# Altium schematic sheet jtag.SchDoc
size A4; SheetNumber: 4; SheetTotal: 7
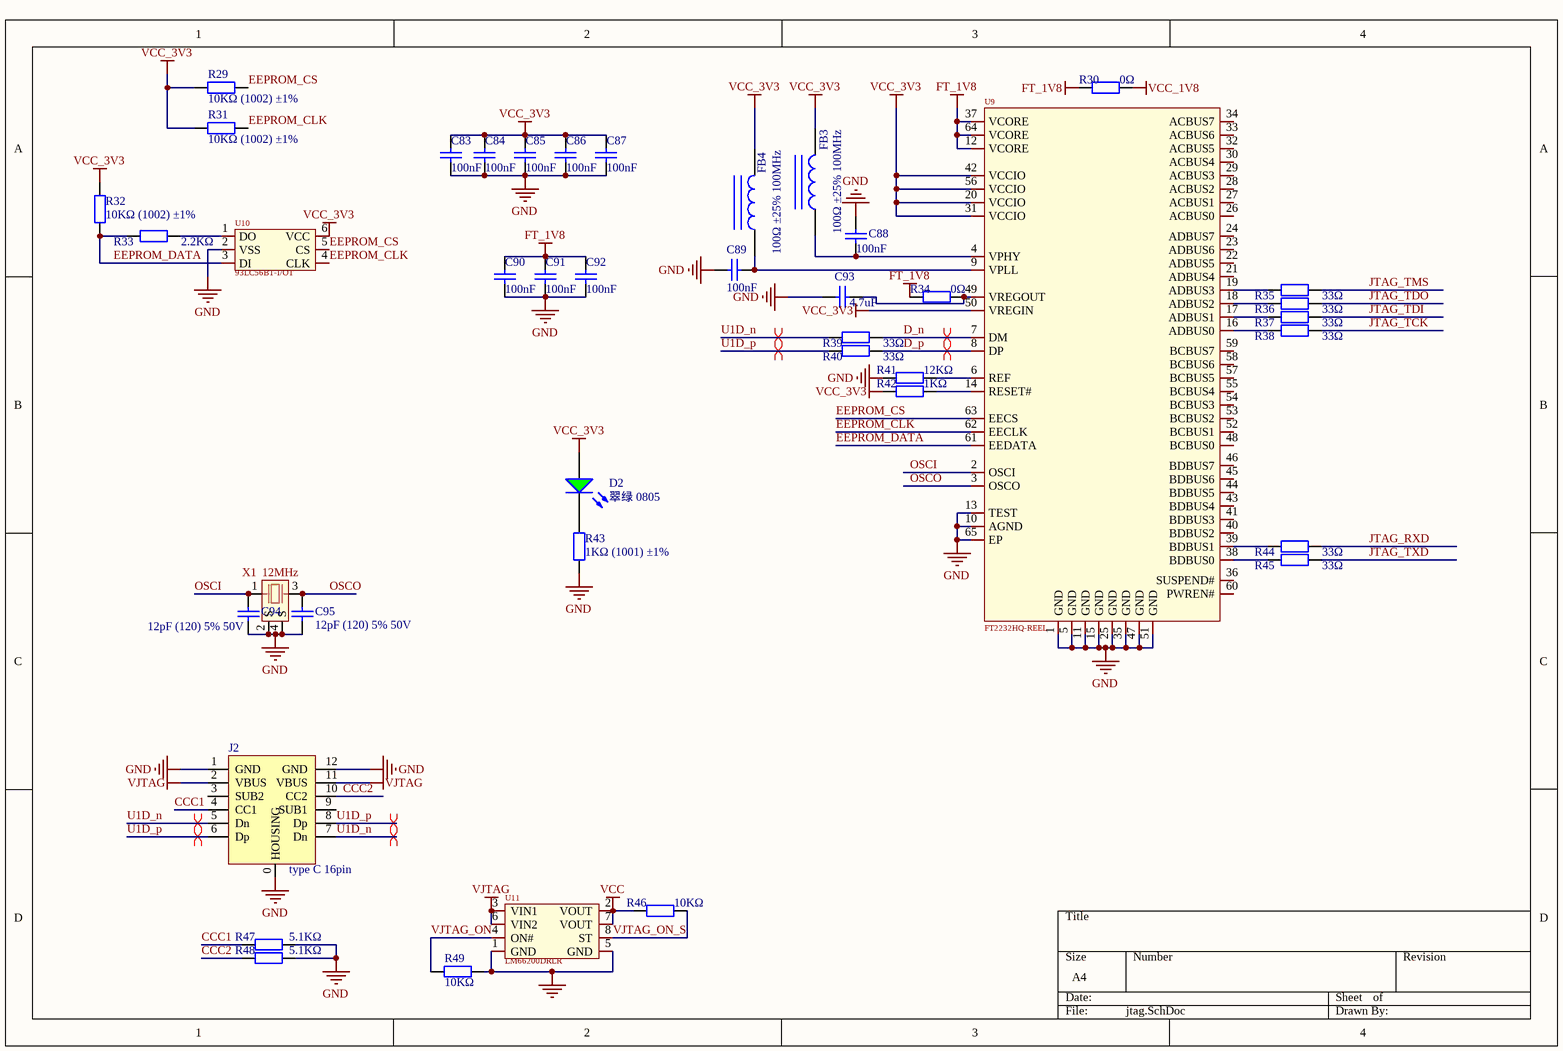
[diagram p0: jtag.SchDoc]

## Parts
C83  100nF  [0805_C]
C84  100nF  [0805_C]
C85  100nF  [0805_C]
C86  100nF  [0805_C]
C87  100nF  [0805_C]
C88  100nF  [0805_C]
C89  100nF  [0805_C]
C90  100nF  [0805_C]
C91  100nF  [0805_C]
C92  100nF  [0805_C]
C93  4.7uF  [0805_C]
C94  12pF (120) 5% 50V  [0805_C]
C95  12pF (120) 5% 50V  [0805_C]
D2  翠绿 0805  [0805_LED_S1]
FB3  100Ω ±25% 100MHz  [0805_L]
FB4  100Ω ±25% 100MHz  [0805_L]
J2  type C 16pin  [USB type C  16pin]
R29  10KΩ (1002) ±1%  [0805_R]
R30  0Ω  [0402_R]
R31  10KΩ (1002) ±1%  [0805_R]
R32  10KΩ (1002) ±1%  [0805_R]
R33  2.2KΩ  [0805_R]
R34  0Ω  [0402_R]
R35  33Ω  [0402_R]
R36  33Ω  [0402_R]
R37  33Ω  [0402_R]
R38  33Ω  [0402_R]
R39  33Ω  [0402_R]
R40  33Ω  [0402_R]
R41  12KΩ  [0805_R]
R42  1KΩ  [0805_R]
R43  1KΩ (1001) ±1%  [0805_R]
R44  33Ω  [0402_R]
R45  33Ω  [0402_R]
R46  10KΩ  [0805_R]
R47  5.1KΩ  [0805_R]
R48  5.1KΩ  [0805_R]
R49  10KΩ  [0805_R]
U9  FT2232HQ-REEL  [QFN-64_L9.0-W9.0-P0.50-TL-EP4.3]
U10  93LC56BT-I/OT  [SOT-23-6_L2.9-W1.6-P0.95-LS2.8-BR]
U11  LM66200DRLR  [SOT-583-8_L2.1-W1.2-P0.50-LS1.6-BL]
X1  12MHz  [3225]

## Nets
FT_1V8: C90.2 C91.2 C92.2 R30.1 R34.1 U9.12(VCORE) U9.37(VCORE) U9.64(VCORE)
GND: C83.1 C84.1 C85.1 C86.1 C87.1 C88.2 C89.2 C90.1 C91.1 C92.1 C93.1 C94.1 C95.1 J2.0(HOUSING) J2.1(GND) J2.12(GND) R41.1 R43.1 R47.2 R48.2 R49.1 U9.1(GND) U9.5(GND) U9.10(AGND) U9.11(GND) U9.13(TEST) U9.15(GND) U9.25(GND) U9.35(GND) U9.47(GND) U9.51(GND) U9.65(EP) U10.2(VSS) U11.1(GND) U11.5(GND) X1.2(S) X1.4(S)
VCC: R46.1 U11.2(VOUT) U11.7(VOUT)
VCC_1V8: R30.2
VCC_3V3: C83.2 C84.2 C85.2 C86.2 C87.2 D2.A FB3.2 FB4.2 R29.2 R31.2 R32.2 R42.1 U9.20(VCCIO) U9.31(VCCIO) U9.42(VCCIO) U9.50(VREGIN) U9.56(VCCIO) U10.6(VCC)
VJTAG: J2.2(VBUS) J2.11(VBUS) U11.3(VIN1) U11.6(VIN2)
CCC1: J2.4(CC1) R47.1
CCC2: J2.10(CC2) R48.1
D_n: R39.2 U9.7(DM)
D_p: R40.2 U9.8(DP)
EEPROM_CLK: R31.1 U9.62(EECLK) U10.4(CLK)
EEPROM_CS: R29.1 U9.63(EECS) U10.5(CS)
EEPROM_DATA: R32.1 R33.1 U9.61(EEDATA) U10.3(DI)
JTAG_RXD: R44.2
JTAG_TCK: R38.2
JTAG_TDI: R37.2
JTAG_TDO: R36.2
JTAG_TMS: R35.2
JTAG_TXD: R45.2
OSCI: C94.2 U9.2(OSCI) X1.1
OSCO: C95.2 U9.3(OSCO) X1.3
U1D_n: J2.5(Dn) J2.7(Dn) R39.1
U1D_p: J2.6(Dp) J2.8(Dp) R40.1
VJTAG_ON: R49.2 U11.4(ON#)
VJTAG_ON_S: R46.2 U11.8(ST)
NetC88_1: C88.1 FB3.1 U9.4(VPHY)
NetC89_1: C89.1 FB4.1 U9.9(VPLL)
NetC93_2: C93.2 R34.2 U9.49(VREGOUT)
NetD2_K: D2.K R43.2
NetR33_2: R33.2 U10.1(DO)
NetR35_1: R35.1 U9.19(ADBUS3)
NetR36_1: R36.1 U9.18(ADBUS2)
NetR37_1: R37.1 U9.17(ADBUS1)
NetR38_1: R38.1 U9.16(ADBUS0)
NetR41_2: R41.2 U9.6(REF)
NetR42_2: R42.2 U9.14(RESET#)
NetR44_1: R44.1 U9.39(BDBUS1)
NetR45_1: R45.1 U9.38(BDBUS0)

Not connected (* = marked no-connect by the designer): J2 3(SUB2) 9(SUB1); U9 21(ADBUS4) 22(ADBUS5) 23(ADBUS6) 24(ADBUS7) 26(ACBUS0) 27(ACBUS1) 28(ACBUS2) 29(ACBUS3) 30(ACBUS4) 32(ACBUS5) 33(ACBUS6) 34(ACBUS7) 36(SUSPEND#) 40(BDBUS2) 41(BDBUS3) 43(BDBUS4) 44(BDBUS5) 45(BDBUS6) 46(BDBUS7) 48(BCBUS0) 52(BCBUS1) 53(BCBUS2) 54(BCBUS3) 55(BCBUS4) 57(BCBUS5) 58(BCBUS6) 59(BCBUS7) 60(PWREN#)

## Layout directives
differential pair: D_n, D_p, U1D_n, U1D_p

## Library data of the parts
C83-C92 = 0805 100nF(104) 10% 50V: 贴片电容; ComponentLink1Description: 供应商链接; ComponentLink1URL: http://www.szlcsc.com/product/details_50686.html; Package: 0805; Supplier: LC; SuppliersPartNumber: C49678
C93 = 0805 4.7uF (475) 10% 25V: 贴片电容; ComponentLink1Description: 供应商链接; ComponentLink1URL: http://www.szlcsc.com/product/details_2131.html; Package: 0805; Supplier: LC; SuppliersPartNumber: C1779
C94 C95 = 0805 12pF (120) 5% 50V: 贴片电容; ComponentLink1Description: 供应商链接; ComponentLink1URL: http://www.szlcsc.com/product/details_2144.html; Package: 0805; Supplier: LC; SuppliersPartNumber: C1792
D2 = 0805 翠绿: 发光二极管; ComponentLink1Description: 供应商链接; ComponentLink1URL: http://www.szlcsc.com/product/details_2670.html; Package: 0805; Supplier: LC; SuppliersPartNumber: C2297
FB3 FB4 = 0805 100Ω 25% 100MHz: 贴片磁珠; ComponentLink1Description: 供应商链接; ComponentLink1URL: http://www.szlcsc.com/product/details_1367.html; Package: 0805; Supplier: LC; SuppliersPartNumber: C1015
J2 = USB type C 16pin: 16针脚C口
R29 R31 R32 R46 R49 = 0805 10KΩ (1002) 1%: 贴片电阻; ComponentLink1Description: 供应商链接; ComponentLink1URL: http://www.szlcsc.com/product/details_18102.html; Package: 0805; Supplier: LC; SuppliersPartNumber: C17414
R30 R34 = 0402 0Ω (0R0) 1%: 贴片电阻; ComponentLink1Description: 供应商链接; ComponentLink1URL: http://www.szlcsc.com/product/details_17853.html; Package: 0402; Supplier: LC; SuppliersPartNumber: C17168
R33 = 0805 2.2KΩ (2201) 1%: 贴片电阻; ComponentLink1Description: 供应商链接; ComponentLink1URL: http://www.szlcsc.com/product/details_18208.html; Package: 0805; Supplier: LC; SuppliersPartNumber: C17520
R35-R40 R44 R45 = 0805 33Ω (33R0) 1%: 贴片电阻; ComponentLink1Description: 供应商链接; ComponentLink1URL: http://www.szlcsc.com/product/details_18322.html; Package: 0805; Supplier: LC; SuppliersPartNumber: C17634
R41 = 0805 12KΩ (1202) 1%: 贴片电阻; ComponentLink1Description: 供应商链接; ComponentLink1URL: http://www.szlcsc.com/product/details_18132.html; Package: 0805; Supplier: LC; SuppliersPartNumber: C17444
R42 R43 = 0805 1KΩ (1001) 1%: 贴片电阻; ComponentLink1Description: 供应商链接; ComponentLink1URL: http://www.szlcsc.com/product/details_18201.html; Package: 0805; Supplier: LC; SuppliersPartNumber: C17513
R47 R48 = 0402 5.1KΩ (5101) 1%: 贴片电阻; ComponentLink1Description: 供应商链接; ComponentLink1URL: http://www.szlcsc.com/product/details_26648.html; Package: 0402; Supplier: LC; SuppliersPartNumber: C25905
U9 = FT2232HQ-REEL: Manufacturer: FTDI(飞特帝亚); Add into BOM: yes; Applications Function: USB转UART；USB转FIFO; Supply Voltage: 3V~3.6V; Symbol: FT2232HQ-REEL; Device: FT2232HQ-REEL; LCSC Part Name: FT2232H 双高速 USB 转多用途 UART/FIFO IC; Supplier Part: C193662; Manufacturer Part: FT2232HQ-REEL; Supplier Footprint: QFN-64-EP(9x9); JLCPCB Part Class: Extended Part; Datasheet: https://atta.szlcsc.com/upload/public/pdf/source/20180530/C193662_F14B45A4B5271BE746E436B0F2E041EE.pdf; Supplier: LCSC; Convert to PCB: yes; Protocol: -; Operating Temperature: -40℃~+85℃
U10 = 93LC56BT-I/OT: Manufacturer: MICROCHIP(美国微芯); Add into BOM: yes; Interface Type: SPI; Memory Size: 2Kbit; Supply Voltage: 2.5V~5.5V; Write Cycle Time (Tw): 6ms; Data Retention - TDR (Year): 200年; Write Cycle Endurance: 1000000次; Symbol: 93LC56BT-I/OT; Device: 93LC56BT-I/OT; LCSC Part Name: 93LC56BT-I/OT; Supplier Part: C190271; Manufacturer Part: 93LC56BT-I/OT; Supplier Footprint: SOT-23-6; JLCPCB Part Class: Extended Part; Datasheet: https://atta.szlcsc.com/upload/public/pdf/source/20140724/1457707164359.pdf; Supplier: LCSC; Convert to PCB: yes; Operating Temperature: -40℃~+85℃
U11 = LM66200DRLR: 理想二极管; Manufacturer: TI(德州仪器); Add into BOM: yes; Symbol: LM66200DRLR; Device: LM66200DRLR; LCSC Part Name: LM66200DRLR; Supplier Part: C3235556; Manufacturer Part: LM66200DRLR; Supplier Footprint: SOT-583; JLCPCB Part Class: Extended Part; Datasheet: https://www.ti.com/cn/lit/gpn/lm66200; Supplier: LCSC; Convert to PCB: yes
X1 = 四脚无源晶体: 4脚贴片无源晶体; Manufacturer: YJX(雅晶鑫); Symbol: TAXM8M4RDBCCT2T; Add into BOM: yes; Value: 8MHz; Normal temperature Frequency Tolerance: ±10ppm; Load Capacitance: 10pF; Frequency Stability: ±15ppm; Equivalent Series Resistance(ESR): 250Ω; Device: TAXM8M4RDBCCT2T; LCSC Part Name: 8MHz ±10ppm 10pF; Supplier Part: C400090; Manufacturer Part: TAXM8M4RDBCCT2T; Supplier Footprint: SMD3225-4P; JLCPCB Part Class: Extended Part; Datasheet: https://atta.szlcsc.com/upload/public/pdf/source/20190626/C400090_CF95B89E745AFE4EF2E392EF8AC009D6.pdf; Supplier: LCSC; Convert to PCB: yes; Type: 贴片晶振; Operating Temperature: -40℃~+85℃